# Altium schematic sheet GC2200.SchDoc
size A4
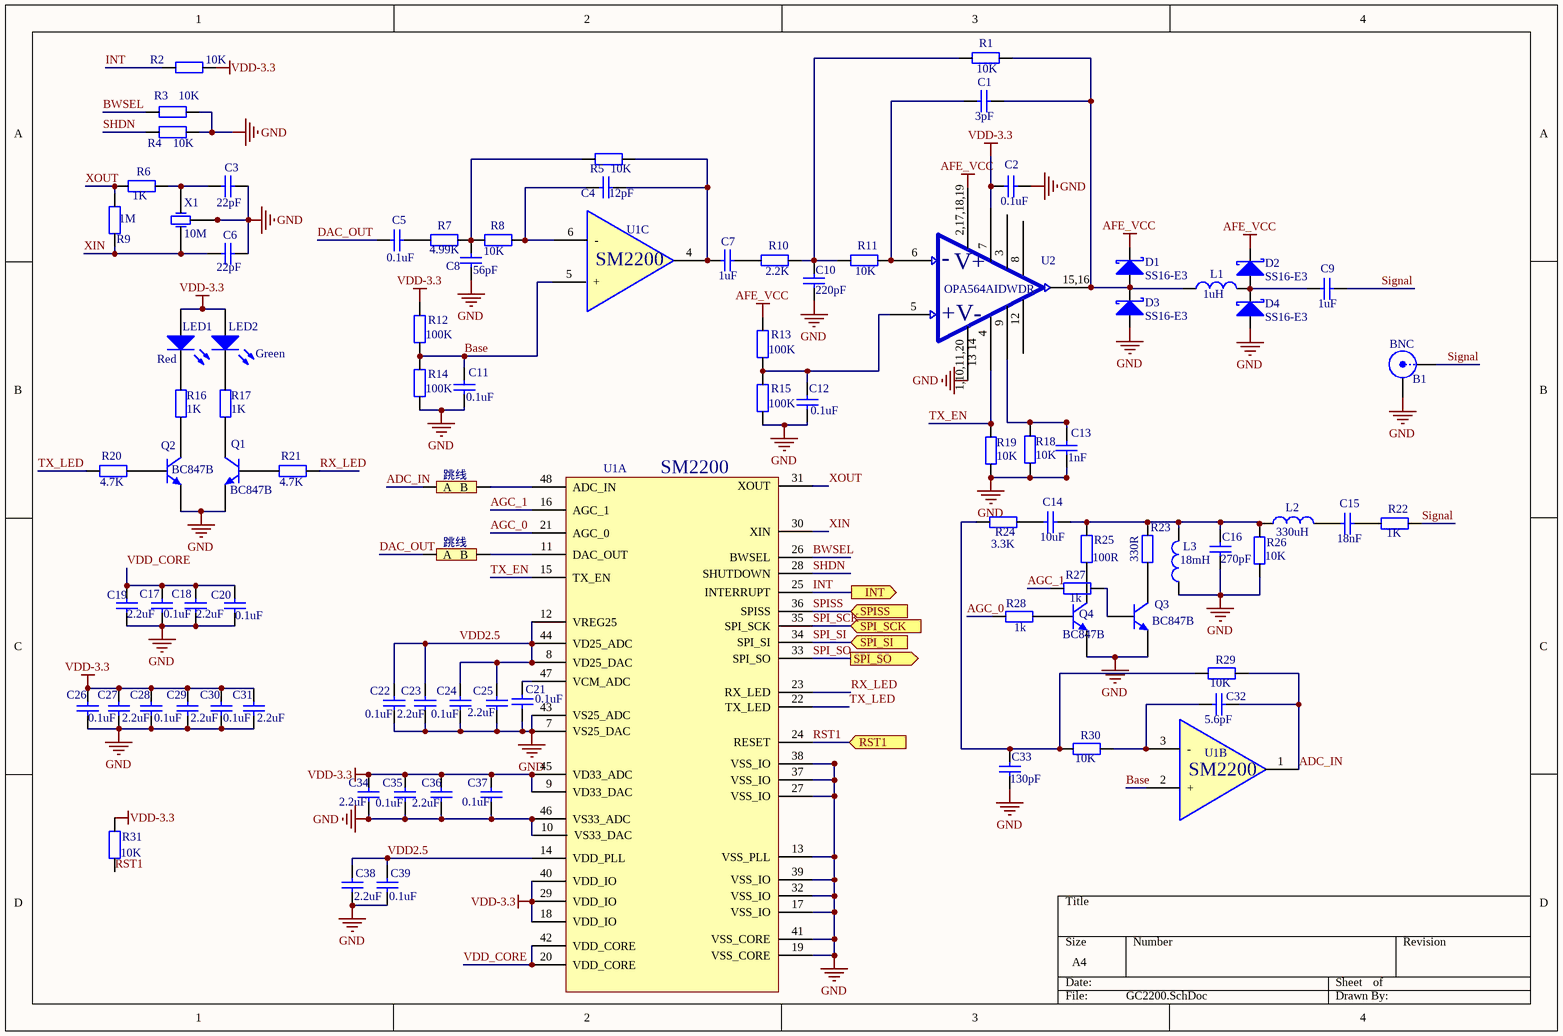
[diagram p0: GC2200.SchDoc]

## Parts
B1  BNC  [BNC]
C1  value 3pF  [0603]  (hidden comment: Capacitor-0603)
C2  value 0.1uF  [0603]  (hidden comment: Capacitor-0603)
C3  value 22pF  [0603]  (hidden comment: Capacitor-0805)
C4  value 12pF  [0603]  (hidden comment: Capacitor-0603)
C5  value 0.1uF  [0603]  (hidden comment: Capacitor-0603)
C6  value 22pF  [0603]  (hidden comment: Capacitor-0805)
C7  value 1uF  [0603]  (hidden comment: Capacitor-0603)
C8  value 56pF  [0603]  (hidden comment: Capacitor-0603)
C9  value 1uF  [0603]  (hidden comment: Capacitor-0603)
C10  value 220pF  [0603]  (hidden comment: Capacitor-0603)
C11  value 0.1uF  [0603]  (hidden comment: Capacitor-0603)
C12  value 0.1uF  [0603]  (hidden comment: Capacitor-0603)
C13  value 1nF  [0603]  (hidden comment: Capacitor-0603)
C14  value 10uF  [0805]  (hidden comment: Capacitor-0603)
C15  value 18nF  [0603]  (hidden comment: Capacitor-0603)
C16  value 270pF  [0603]  (hidden comment: Capacitor-0603)
C17  value 0.1uF  [0603]  (hidden comment: Capacitor-0805)
C18  value 2.2uF  [0603]  (hidden comment: Capacitor-0805)
C19  value 2.2uF  [0603]  (hidden comment: Capacitor-0805)
C20  value 0.1uF  [0603]  (hidden comment: Capacitor-0805)
C21  value 0.1uF  [0603]  (hidden comment: Capacitor-0805)
C22  value 0.1uF  [0603]  (hidden comment: Capacitor-0805)
C23  value 2.2uF  [0603]  (hidden comment: Capacitor-0805)
C24  value 0.1uF  [0603]  (hidden comment: Capacitor-0805)
C25  value 2.2uF  [0603]  (hidden comment: Capacitor-0805)
C26  value 0.1uF  [0603]  (hidden comment: Capacitor-0805)
C27  value 2.2uF  [0603]  (hidden comment: Capacitor-0805)
C28  value 0.1uF  [0603]  (hidden comment: Capacitor-0805)
C29  value 2.2uF  [0603]  (hidden comment: Capacitor-0805)
C30  value 0.1uF  [0603]  (hidden comment: Capacitor-0805)
C31  value 2.2uF  [0603]  (hidden comment: Capacitor-0805)
C32  value 5.6pF  [0603]  (hidden comment: Capacitor-0603)
C33  value 130pF  [0603]  (hidden comment: Capacitor-0603)
C34  value 2.2uF  [0603]  (hidden comment: Capacitor-0805)
C35  value 0.1uF  [0603]  (hidden comment: Capacitor-0805)
C36  value 2.2uF  [0603]  (hidden comment: Capacitor-0805)
C37  value 0.1uF  [0603]  (hidden comment: Capacitor-0805)
C38  value 2.2uF  [0603]  (hidden comment: Capacitor-0805)
C39  value 0.1uF  [0603]  (hidden comment: Capacitor-0805)
D1  Name: SS16-E3  [IN5824]  (hidden comment: SSA34)
D2  Name: SS16-E3  [IN5824]  (hidden comment: SSA34)
D3  Name: SS16-E3  [IN5824]  (hidden comment: SSA34)
D4  Name: SS16-E3  [IN5824]  (hidden comment: SSA34)
L1  value 1uH  [1206]  (hidden comment: Inductor)
L2  value 330uH  [Inductor  12*12]  (hidden comment: Inductor)
L3  value 18mH  [工字电感0608]  (hidden comment: Inductor)
LED1  Color: Red  [外插小灯]  (hidden comment: LED)
LED2  Color: Green  [外插小灯]  (hidden comment: LED)
Q1  BC847  [BC847B]  (value not drawn)
Q2  BC847  [BC847B]  (value not drawn)
Q3  BC847  [BC847B]  (value not drawn)
Q4  BC847  [BC847B]  (value not drawn)
R1  value 10K  [0603]  (hidden comment: Resistor-0603)
R2  value 10K  [0603]  (hidden comment: Resistor-0805)
R3  value 10K  [0603]  (hidden comment: Resistor-0805)
R4  value 10K  [0603]  (hidden comment: Resistor-0805)
R5  value 10K  [0603]  (hidden comment: Resistor-0603)
R6  value 1K  [0603]  (hidden comment: Resistor-0805)
R7  value 4.99K  [0603]  (hidden comment: Resistor-0603)
R8  value 10K  [0603]  (hidden comment: Resistor-0603)
R9  value 1M  [0603]  (hidden comment: Resistor-0805)
R10  value 2.2K  [0603]  (hidden comment: Resistor-0603)
R11  value 10K  [0603]  (hidden comment: Resistor-0603)
R12  value 100K  [0603]  (hidden comment: Resistor-0603)
R13  value 100K  [0603]  (hidden comment: Resistor-0603)
R14  value 100K  [0603]  (hidden comment: Resistor-0603)
R15  value 100K  [0603]  (hidden comment: Resistor-0603)
R16  value 1K  [0603]  (hidden comment: Resistor-0805)
R17  value 1K  [0603]  (hidden comment: Resistor-0805)
R18  value 10K  [0603]  (hidden comment: Resistor-0603)
R19  value 10K  [0603]  (hidden comment: Resistor-0603)
R20  value 4.7K  [0603]  (hidden comment: Resistor-0805)
R21  value 4.7K  [0603]  (hidden comment: Resistor-0805)
R22  value 1K  [0603]  (hidden comment: Resistor-0603)
R23  value 330R  [0603]  (hidden comment: Resistor-0603)
R24  value 3.3K  [0603]  (hidden comment: Resistor-0603)
R25  value 100R  [0603]  (hidden comment: Resistor-0603)
R26  value 10K  [0603]  (hidden comment: Resistor-0603)
R27  value 1k  [0603]  (hidden comment: Resistor-0603)
R28  value 1k  [0603]  (hidden comment: Resistor-0603)
R29  value 10K  [0603]  (hidden comment: Resistor-0603)
R30  value 10K  [0603]  (hidden comment: Resistor-0603)
R31  value 10K  [0603]  (hidden comment: Resistor-0805)
T1  跳线  [跳线 100mil]
T2  跳线  [跳线 100mil]
U1  SM2200  [SM2200]  (parts A,B,C of 3)
U2  OPA564AIDWDR  [OPA564AIDWDR]
X1  value 10M  [3225无源晶振]  (hidden comment: 3225无源晶振)

## Ports
INT (out), RST1 (in), SPI_SCK (in), SPI_SI (in), SPI_SO (out), SPISS (in)

## Nets
AFE_VCC: D1.2(K) D2.2(K) R13.2 U2.2,17,18,19
GND: B1.1(Y) C2.1 C3.2 C6.2 C8.1 C10.2 C11.1 C12.2 C13.1 C16.2 C17.1 C18.1 C19.1 C20.1 C21.1 C22.1 C23.1 C24.1 C25.1 C26.1 C27.1 C28.1 C29.1 C30.1 C31.1 C33.2 C34.1 C35.1 C36.1 C37.1 C38.1 C39.1 D3.1(A) D4.1(A) L3.1 Q1.1(E) Q2.1(E) Q3.1(E) Q4.1(E) R3.2 R4.2 R14.1 R15.1 R18.1 R19.1 R26.1 U1.7(VS25_DAC) U1.10(VS33_DAC) U1.13(VSS_PLL) U1.17(VSS_IO) U1.19(VSS_CORE) U1.27(VSS_IO) U1.32(VSS_IO) U1.37(VSS_IO) U1.38(VSS_IO) U1.39(VSS_IO) U1.41(VSS_CORE) U1.43(VS25_ADC) U1.46(VS33_ADC) U2.1,10,11,20 X1.2(GND) X1.4(GND)
VDD-3.3: C2.2 C26.2 C27.2 C28.2 C29.2 C30.2 C31.2 C34.2 C35.2 C36.2 C37.2 LED1.1(A) LED2.1(A) R2.2 R12.2 R31.1 U1.9(VD33_DAC) U1.18(VDD_IO) U1.29(VDD_IO) U1.40(VDD_IO) U1.45(VD33_ADC) U2.7
ADC_IN: C32.2 R29.1 T1.1(A) U1.1
AGC_0: R28.2 U1.21(AGC_0)
AGC_1: R27.2 U1.16(AGC_1)
Base: C11.2 R12.1 R14.2 U1.2(+) U1.5(+)
BWSEL: R3.1 U1.26(BWSEL)
DAC_OUT: C5.2 T2.1(A)
INT: R2.1 U1.25(INTERRUPT) ; port INT
RST1: R31.2 U1.24(RESET) ; port RST1
RX_LED: R21.1 U1.23(RX_LED)
SHDN: R4.1 U1.28(SHUTDOWN)
Signal: B1.2(X) C9.1 R22.2
SPI_SCK: U1.35(SPI_SCK) ; port SPI_SCK
SPI_SI: U1.34(SPI_SI) ; port SPI_SI
SPI_SO: U1.33(SPI_SO) ; port SPI_SO
SPISS: U1.36(SPISS) ; port SPISS
TX_EN: R19.2 U1.15(TX_EN) U2.4
TX_LED: R20.2 U1.22(TX_LED)
VDD2.5: C22.2 C23.2 C24.2 C25.2 C38.2 C39.2 U1.8(VD25_DAC) U1.12(VREG25) U1.14(VDD_PLL) U1.44(VD25_ADC)
VDD_CORE: C17.2 C18.2 C19.2 C20.2 U1.20(VDD_CORE) U1.42(VDD_CORE)
XIN: C6.1 R9.1 U1.30(XIN) X1.1(OSC1)
XOUT: R6.1 R9.2 U1.31(XOUT)
NetC1_1: C1.1 D1.1(A) D3.2(K) L1.1 R1.2 U2.15,16
NetC1_2: C1.2 R11.2 U2.6
NetC3_1: C3.1 R6.2 X1.3(OSC2)
NetC4_1: C4.1 C7.2 R5.2 U1.4
NetC4_2: C4.2 R8.2 U1.6(-)
NetC5_1: C5.1 R7.1
NetC7_1: C7.1 R10.1
NetC8_2: C8.2 R5.1 R7.2 R8.1
NetC9_2: C9.2 D2.1(A) D4.2(K) L1.2
NetC10_1: C10.1 R1.1 R10.2 R11.1
NetC12_1: C12.1 R13.1 R15.2 U2.5
NetC13_2: C13.2 R18.2 U2.9
NetC14_1: C14.1 C16.1 L2.1 L3.2 R23.2 R25.2 R26.2
NetC14_2: C14.2 R24.1
NetC15_1: C15.1 R22.1
NetC15_2: C15.2 L2.2
NetC21_2: C21.2 U1.47(VCM_ADC)
NetC32_1: C32.1 R30.1 U1.3(-)
NetC33_1: C33.1 R24.2 R29.2 R30.2
NetLED1_2: LED1.2 R16.2
NetLED2_2: LED2.2 R17.2
NetQ1_2: Q1.2(B) R21.2
NetQ1_3: Q1.3(C) R17.1
NetQ2_2: Q2.2(B) R20.1
NetQ2_3: Q2.3(C) R16.1
NetQ3_2: Q3.2(B) R27.1
NetQ3_3: Q3.3(C) R23.1
NetQ4_2: Q4.2(B) R28.1
NetQ4_3: Q4.3(C) R25.1
NetT1_2: T1.2(B) U1.48(ADC_IN)
NetT2_2: T2.2(B) U1.11(DAC_OUT)

Not connected (* = marked no-connect by the designer): U2 3 8 12

## Notes on the sheet
- (in symbol OPA564AIDWDR) -; V+; +; V-; 14; 13

## Library data of the parts
C3 C6 C17-C31 C34-C39 = Capacito
R2-R4 R6 R9 R16 R17 R20 R21 R31 = Resisto
U2 = OPA564AIDWDR: pin to pad: 1,10,11,20>1+10+11+20+13+14; Name: OPA564AIDWDR
B1 = BNC: Name: BNC
LED1 LED2 = LED: Value: LED
Q1-Q4 = BC847: Name: BC847B
T1 T2 = 跳线: Value: 跳线